# EasyEDA Pro project 单向户外电源_明月班.epro, schematic Schematic3
Board Name: 后级2; Create Date: 2025-10-12; Page Name: P1; Project Name: 单向户外电源; Schematic Name: Schematic3; Update Date: 2025-10-12; Company: 嘉立创EDA; Page Size: A4; Version: V1.0
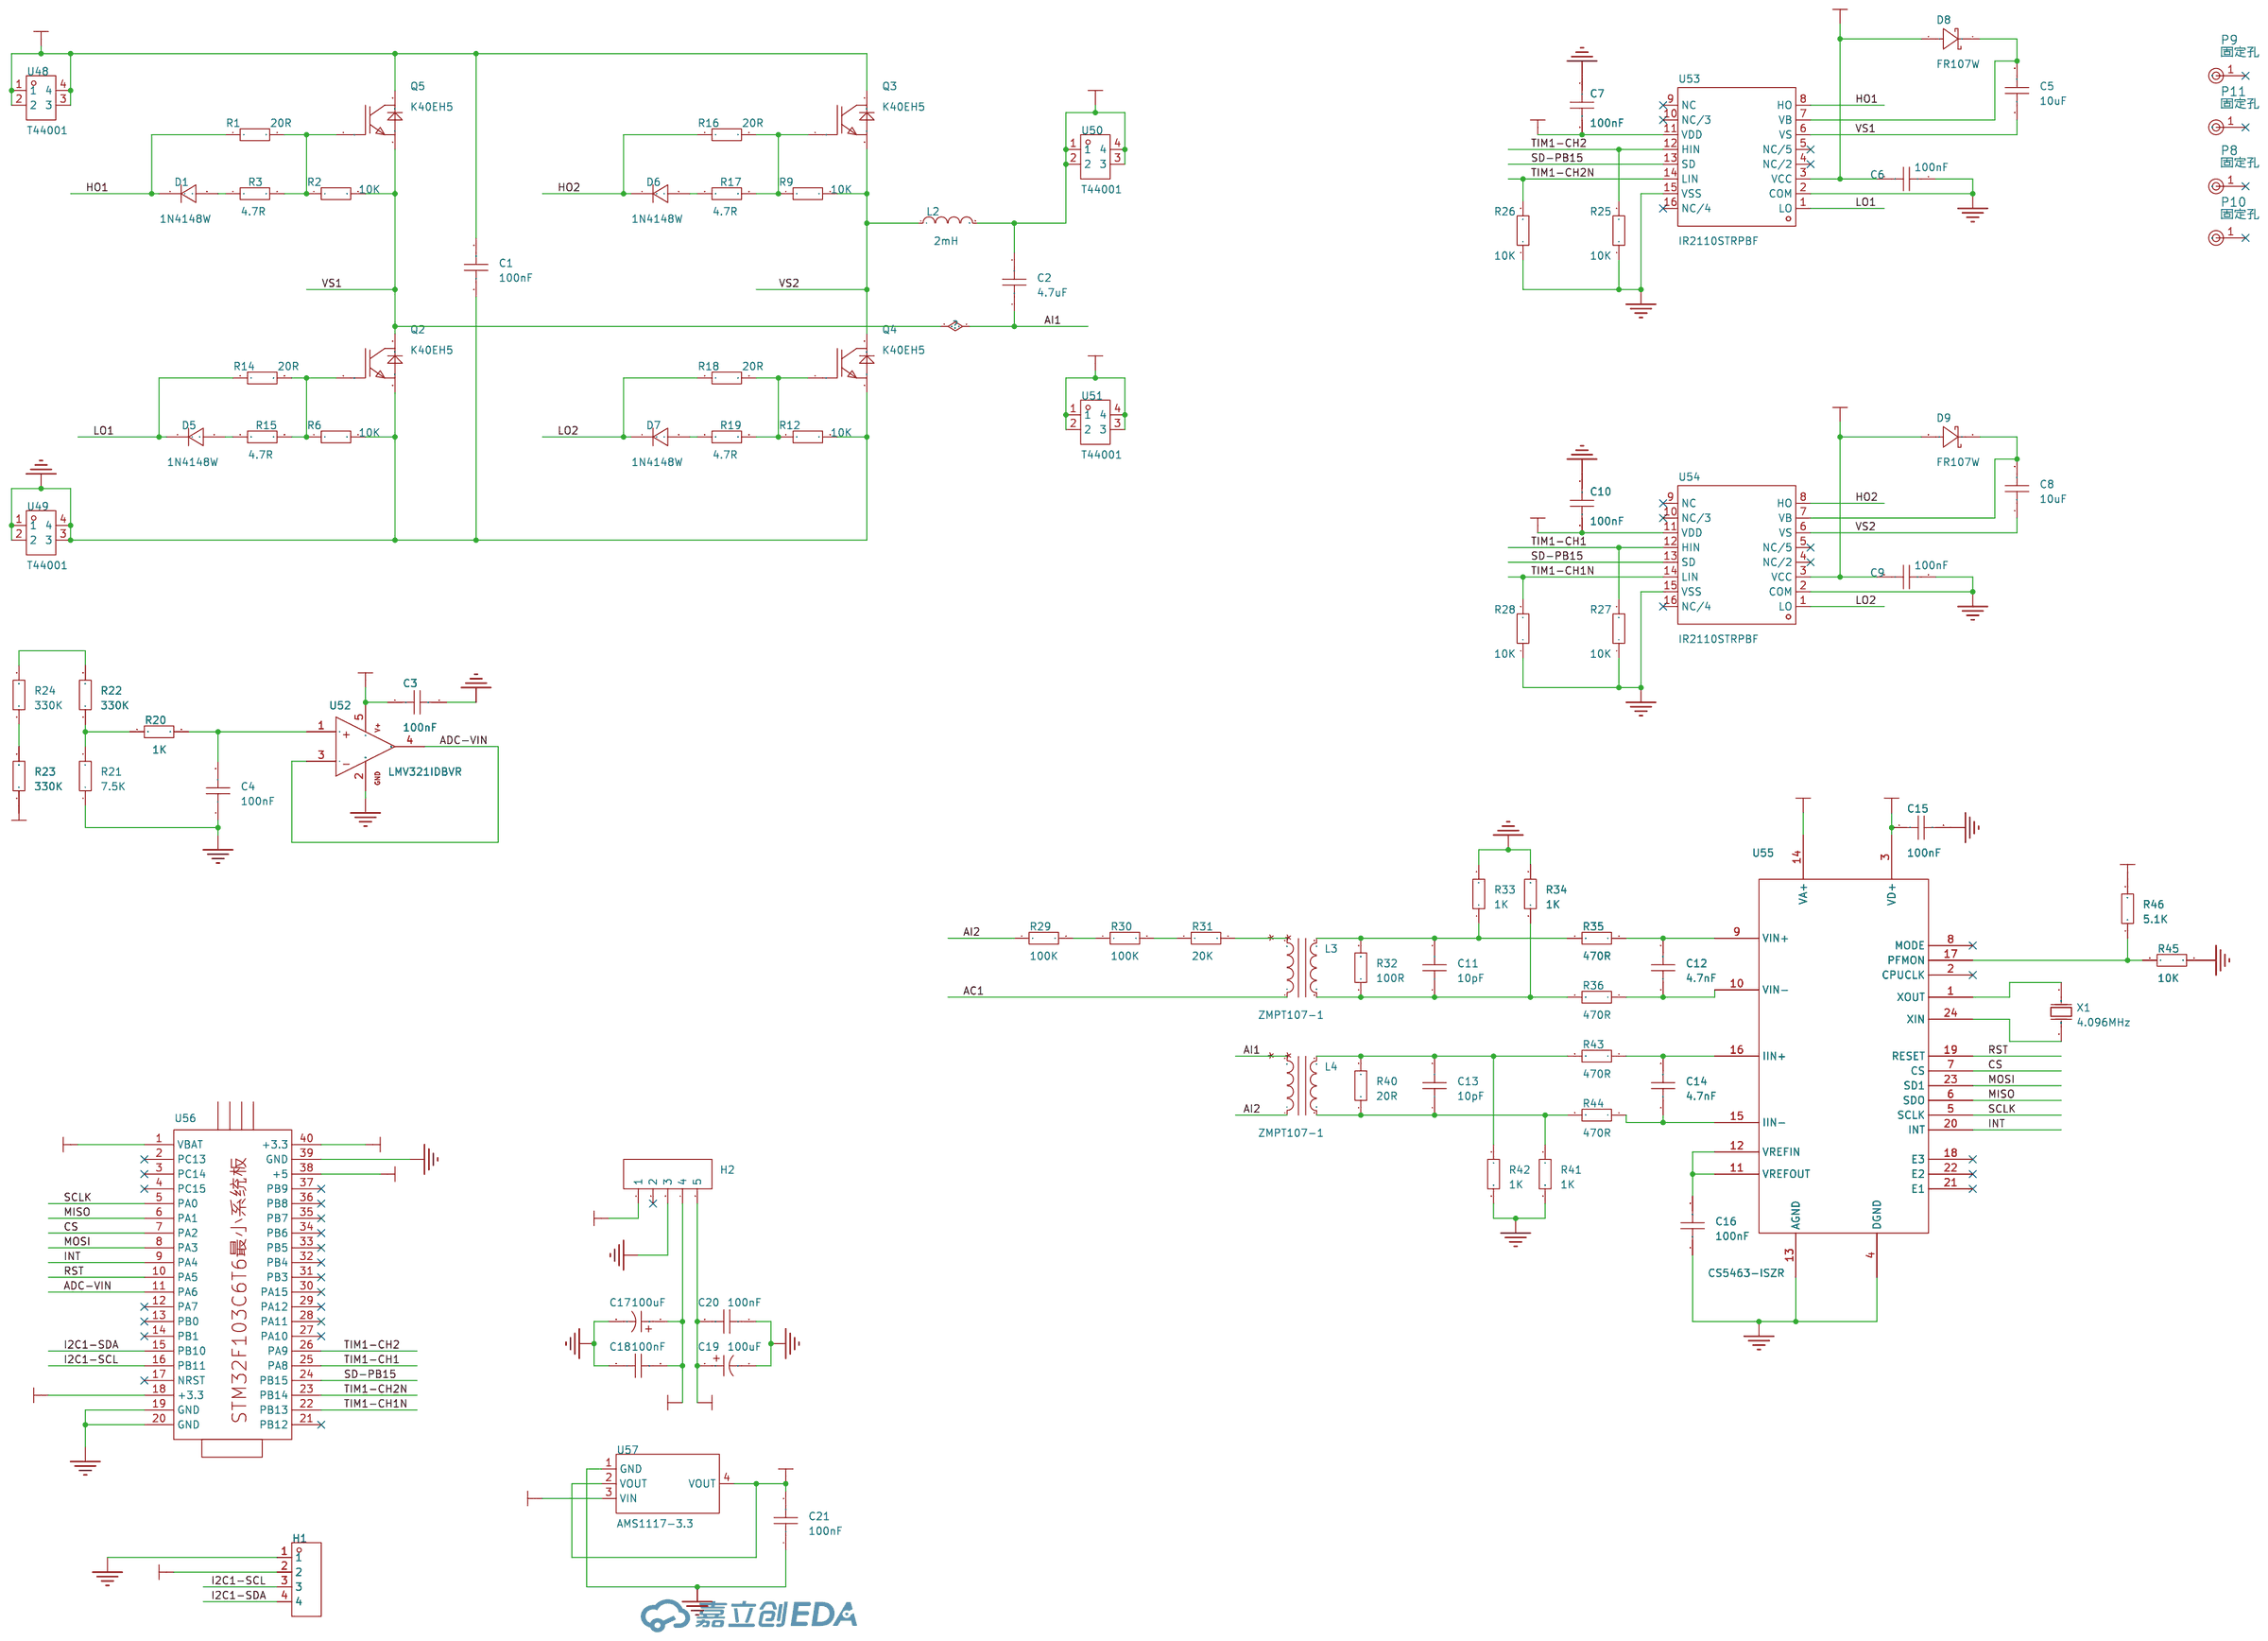
[diagram p1: schematic sheet]

## Parts
C1  100nF  [CAP-TH_L11.5-W5.5-P10.00-D0.6]
C2  4.7uF  [CAP-TH_L28.5-W15.5-P26.0-D0.8]
C3  100nF  [C0805]
C4  100nF  [C0805]
C5  10uF  [C0805]
C6  100nF  [C0805]
C7  100nF  [C0805]
C8  10uF  [C0805]
C9  100nF  [C0805]
C10  100nF  [C0805]
C11  10pF  [C0805]
C12  4.7nF  [C0805]
C13  10pF  [C0805]
C14  4.7nF  [C0805]
C15  100nF  [C0805]
C16  100nF  [C0805]
C17  100uF  [CAP-TH_BD5.0-P2.00-D0.5-FD-1]
C18  100nF  [C0805]
C19  100uF  [CAP-TH_BD5.0-P2.00-D0.5-FD-1]
C20  100nF  [C0805]
C21  100nF  [C0805]
D1  1N4148W  [SOD-123F_L2.7-W1.6-LS3.8-RD]
D5  1N4148W  [SOD-123F_L2.7-W1.6-LS3.8-RD]
D6  1N4148W  [SOD-123F_L2.7-W1.6-LS3.8-RD]
D7  1N4148W  [SOD-123F_L2.7-W1.6-LS3.8-RD]
D8  FR107W  [SOD-123FL_L2.7-W1.8-LS3.8-RD]
D9  FR107W  [SOD-123FL_L2.7-W1.8-LS3.8-RD]
H1  -  [HDR-TH_4P-P2.54-V-F]
H2  -  [EG1185辅助电源]
L2  2mH  [2mH-D=36,插件脚距16]
L3  ZMPT107-1  [XFMR-TH_ZMPT107-1]
L4  ZMPT107-1  [XFMR-TH_ZMPT107-1]
P8  固定孔  [固定孔]
P9  固定孔  [固定孔]
P10  固定孔  [固定孔]
P11  固定孔  [固定孔]
Q2  K40EH5  [TO-247AC-3_L15.8-W5.0-P5.46-L]
Q3  K40EH5  [TO-247AC-3_L15.8-W5.0-P5.46-L]
Q4  K40EH5  [TO-247AC-3_L15.8-W5.0-P5.46-L]
Q5  K40EH5  [TO-247AC-3_L15.8-W5.0-P5.46-L]
R1  20R  [R0805]
R2  10K  [R0805]
R3  4.7R  [R0805]
R6  10K  [R0805]
R9  10K  [R0805]
R12  10K  [R0805]
R14  20R  [R0805]
R15  4.7R  [R0805]
R16  20R  [R0805]
R17  4.7R  [R0805]
R18  20R  [R0805]
R19  4.7R  [R0805]
R20  1K  [R0805]
R21  7.5K  [R0805]
R22  330K  [R0805]
R23  330K  [R0805]
R24  330K  [R0805]
R25  10K  [R0805]
R26  10K  [R0805]
R27  10K  [R0805]
R28  10K  [R0805]
R29  100K  [R0805]
R30  100K  [R0805]
R31  20K  [R0805]
R32  100R  [R0805]
R33  1K  [R0805]
R34  1K  [R0805]
R35  470R  [R0805]
R36  470R  [R0805]
R40  20R  [R0805]
R41  1K  [R0805]
R42  1K  [R0805]
R43  470R  [R0805]
R44  470R  [R0805]
R45  10K  [R0805]
R46  5.1K  [R0805]
U48  T44001  [CONN-TH_T44001]
U49  T44001  [CONN-TH_T44001]
U50  T44001  [CONN-TH_T44001]
U51  T44001  [CONN-TH_T44001]
U52  LMV321IDBVR  [SOT-23-5_L3.0-W1.7-P0.95-LS2.8-BR]
U53  IR2110STRPBF  [SOIC-16_L10.3-W7.5-P1.27-LS10.3-BL]
U54  IR2110STRPBF  [SOIC-16_L10.3-W7.5-P1.27-LS10.3-BL]
U55  CS5463-ISZR  [SSOP-24_L8.1-W5.3-P0.65-LS7.8-BL]
U56  -  [STM32F103C8T6最小系统板]
U57  AMS1117-3.3  [SOT-223-3_L6.5-W3.4-P2.30-LS7.0-BR]
X1  4.096MHz  [HC-49US_L11.5-W4.5-P4.88]

## Library data of the parts
C1 = CBB21-630V104JP10: 容值:100nF;精度:±5%;额定电压:630V;工作温度:-40℃~+105℃;; LCSC Part Name: 100nF ±5% 630V; Supplier Part: C2888191; Manufacturer: 东通电子; Supplier Footprint: 插件,P=10mm; JLCPCB Part Class: 扩展库; Datasheet: https://atta.szlcsc.com/upload/public/pdf/source/20210928/C2888191_1A852CE2E5E8A960951618999EAEF1BB.pdf; Supplier: LCSC; Tolerance: ±5%; Voltage Rated: 630V; Operating Temperature: -40℃~+105℃
C2 = KP475J2J2603: 容值:4.7uF;精度:±5%;额定电压:630V;工作温度:-40℃~+100℃;; LCSC Part Name: 4.7uF ±5% 630V; Supplier Part: C3019080; Manufacturer: KYET(科雅); Supplier Footprint: 插件,P=26mm; JLCPCB Part Class: 扩展库; Datasheet: https://atta.szlcsc.com/upload/public/pdf/source/20220523/12B2B36D66F3FE6DA8C3B05150F96247.pdf; Supplier: LCSC; Tolerance: ±5%; Voltage Rated: 630V; Operating Temperature: -40℃~+100℃
C3-C16 C21 = CAP_0603: Supplier Footprint: 0603
C17 C19 = JBLE2101M025A080RLM 100UF 25V: 容值:100uF;精度:±20%;额定电压:25V;纹波电流:1.1A@100kHz;等效串联电阻(ESR):40mΩ@100kHz;; LCSC Part Name: 100uF ±20% 25V; Supplier Part: C19270657; Manufacturer: DMBJ(振宝佳); Supplier Footprint: 插件,D5xL8mm; JLCPCB Part Class: 扩展库; Datasheet: https://atta.szlcsc.com/upload/public/pdf/source/20240115/41B2053578AA7A05F5193847DE8DA961.pdf; Supplier: LCSC; Tolerance: ±20%; Voltage Rating: 25V; Ripple Current: 1.1A@100kHz; Equivalent Series Resistance(ESR): 40mΩ@100kHz; Lifetime: 2000hrs@105℃
C18 C20 = CAP_0805: Supplier Footprint: 0805
D1 D5-D7 = 1N4148W_C81598: 二极管配置:独立式;正向压降(Vf):1V@50mA;直流反向耐压(Vr):75V;整流电流:150mA;反向恢复时间(Trr):4ns;; Supplier Part: C81598; Manufacturer: ST(先科); Supplier Footprint: SOD-123; JLCPCB Part Class: 基础库; Datasheet: https://item.szlcsc.com/datasheet/1N4148W/82750.html; Supplier: LCSC; Diode Configuration: 独立式; Voltage - Forward(Vf@If): 1V@50mA; Voltage - DC Reverse(Vr): 75V; Current - Rectified: 150mA; Pd - Power Dissipation: 400mW; Reverse Leakage Current (Ir): 1uA@75V; Reverse Recovery Time (trr): 4ns; Non-Repetitive Peak Forward Surge Current: 1A
D8 D9 = FR107W_C18199114: 二极管配置:独立式;正向压降(Vf):1.3V@1.0A;直流反向耐压(Vr):1kV;整流电流:1A;反向恢复时间(Trr):500ns;; LCSC Part Name: 耐压:1000V 电流:1A 反向恢复时间：500ns; Supplier Part: C18199114; Manufacturer: R+O(宏嘉诚); Supplier Footprint: SOD-123FL; JLCPCB Part Class: 扩展库; Datasheet: https://item.szlcsc.com/datasheet/FR107W/19354346.html; Supplier: LCSC; Diode Configuration: 独立式; Voltage - Forward(Vf@If): 1.3V@1.0A; Voltage - DC Reverse(Vr): 1kV; Current - Rectified: 1A; Reverse Leakage Current (Ir): 2uA@1000V; Reverse Recovery Time (trr): 500ns; Operating Junction Temperature Range: -55℃~+150℃; Non-Repetitive Peak Forward Surge Current: 30A
H1 = HDR-F_2.54_1x4P: Supplier Part: C2718488; Supplier Footprint: 插件
H2 = HDR-F_2.54_1x5P: Supplier Part: C50950; Supplier Footprint: 插件
L2 = XR050125T101MVL7: 电感值:100uH;精度:±10%;额定电流:3.8A;类型:磁环电感;; LCSC Part Name: 100uH ±10% 磁环电感; Supplier Part: C18213920; Manufacturer: XR(祥如); Supplier Footprint: 插件,D=15.8mm; JLCPCB Part Class: 扩展库; Datasheet: https://atta.szlcsc.com/upload/public/pdf/source/20231010/3953EFE02023CF281EBE5E0AF59C2C67.pdf; Supplier: LCSC; Tolerance: ±10%; Rated Current: 3.8A; Type: 磁环电感; Wire Diameter: 0.7mm
L3 L4 = ZMPT107-1_C125191: 类型:电压互感器;匝数比:1:1;额定输入电流:2mA;额定输出电流:2mA;频率:-;次级侧电感值:-;; Supplier Part: C125191; Manufacturer: 择明朗熙; Supplier Footprint: 插件; JLCPCB Part Class: 扩展库; Datasheet: https://item.szlcsc.com/datasheet/ZMPT107-1/136467.html; Supplier: LCSC; Type: 电压互感器; Turns Ratio: 1:1; Rated input Current: 2mA; Rated Output Current: 2mA; Linearity: 0.2%
P8-P11 = 固定孔
Q2-Q5 = IKW20N60T: Vce=600V，Ic=20A，Vce(sat)=1.5V; Supplier Part: C10456; Manufacturer: Infineon(英飞凌); Supplier Footprint: TO-247AC-3; JLCPCB Part Class: 扩展库; Datasheet: https://atta.szlcsc.com/upload/public/pdf/source/20121215/1457706569365.pdf; Supplier: LCSC
R1-R3 R6 R9 R12 R14-R19 = Res_0805: Supplier Footprint: 0805
R20-R36 R40-R46 = Res_0603: Supplier Footprint: 0603
U48-U51 = T44001: LCSC Part Name: 四脚 M4 二件套; Supplier Part: C481447; Manufacturer: XFCN(兴飞); Supplier Footprint: 插件; JLCPCB Part Class: 扩展库; Datasheet: https://atta.szlcsc.com/upload/public/pdf/source/20200107/C481448_4214B4EB74A46B70BD82BA8A456D4EDD.pdf; Supplier: LCSC
U52 = LMV321IDBVR_C7972: 放大器数:单路;轨到轨:轨到轨输出;增益带宽积(GBP):1MHz;输入失调电压(Vos):7mV;压摆率(SR):1V/us;输入偏置电流(Ib):11nA;; LCSC Part Name: 低电压轨到轨输出运算放大器; Supplier Part: C7972; Manufacturer: TI(德州仪器); Supplier Footprint: SOT-23-5; JLCPCB Part Class: 扩展库; Datasheet: https://www.ti.com/cn/lit/gpn/lmv321; Supplier: LCSC; Number of Channels: 单路; Maximum Power Supply Range (Vdd-Vss): 5.5V; Rail to Rail: 轨到轨输出; Gain Bandwidth Product: 1MHz; Vos - Input Offset Voltage: 7mV; Input Offset Voltage Drift(Vos TC): 9uV/℃; Slew Rate: 1V/us; Ib - Input Bias Current: 11nA; Input Offset Current(Ios): 5nA; Noise density(eN): 46nV/√Hz@1kHz; Common Mode Rejection Ratio(CMRR): 63dB; Quiescent Current: 170uA; Output Current: 5mA; Operating Temperature: -40℃~+125℃; Single supply: 2.7V~5.5V
U53 U54 = IR2110STRPBF: 驱动配置:半桥;负载类型:IGBT；MOSFET;驱动通道数:2;灌电流(IOL):2A;拉电流(IOH):2A;工作电压:10V~20V;上升时间(tr):110ns;下降时间(tf):25ns;; LCSC Part Name: 高端和低端驱动器; Supplier Part: C2968; Manufacturer: Infineon(英飞凌); Supplier Footprint: SOIC-16-300mil; JLCPCB Part Class: 扩展库; Datasheet: https://item.szlcsc.com/datasheet/IR2110STRPBF/3350.html; Supplier: LCSC; Driven Configuration: 半桥; Load Type: IGBT；MOSFET; Number of Drivers: 2; Current - Output Low(IOL): 2A; Current - Output High(IOH): 2A; Voltage - Supply: 10V~20V; Rise Time: 110ns; Fall Time: 25ns; Propagation Delay tpLH: 120ns; Propagation Delay tpHL: 94ns; Features: 欠压保护(UVP); Operating Temperature: -40℃~+150℃@(Tj); Quiescent Current(Iq): 180uA
U55 = CS5463
U56 = STM32F103C6T6
U57 = AMS1117-3.3_C6186: 输出类型:固定;工作电压:16V;输出电压:3.3V;输出电流:1A;电源纹波抑制比(PSRR):72dB@(120Hz);输出极性:正极;; LCSC Part Name: 输出3.3V 1A; Supplier Part: C6186; Manufacturer: AMS; Supplier Footprint: SOT-223; JLCPCB Part Class: 基础库; Datasheet: https://item.szlcsc.com/datasheet/AMS1117-3.3/6652.html; Supplier: LCSC; Output Type: 固定; Voltage - Supply: 16V; Output Voltage: 3.3V; Output Current: 1A; Power Supply Rejection Ratio (PSRR): 72dB@(120Hz); Voltage Dropout: 1.1V@(800mA); standby current: 5mA; Features: 过流保护；过热保护; Operating Temperature: -40℃~+125℃; Output Configuration: 正极; Number of Outputs: 1
X1 = X49SD4096MSD2SC-1: 晶振类型:直插晶振;频率:4.096MHz;常温频差:±20ppm;负载电容:20pF;频率稳定度:±30ppm;; LCSC Part Name: HC-49US 4.096MHZ 2P 49S 20PF ±20PPM -20~70℃（±30PPM）; Supplier Part: C2226; Manufacturer: YXC(扬兴晶振); Supplier Footprint: HC-49S; JLCPCB Part Class: 扩展库; Datasheet: https://item.szlcsc.com/datasheet/X49SD4096MSD2SC-1/2595.html; Supplier: LCSC; Type: 直插晶振; Normal temperature Frequency Tolerance: ±20ppm; Load Capacitance: 20pF; Frequency Stability: ±30ppm; Operating Temperature: -20℃~+70℃

## Nets
3.3V: C3.1 C7.2 C10.2 C15.1 C21.2 U52.5(V+) U53.11(VDD) U54.11(VDD) U55.3(VD+) U56.1(VBAT) U56.18(+3.3) U56.40(+3.3) U57.2(VOUT) U57.4(VOUT)
5V: C19.1 C20.2 H1.2 H2.5 R46.2 U55.14(VA+) U56.38(+5) U57.3(VIN)
15V: C6.2 C9.2 C17.1 C18.2 D8.2(A) D9.2(A) H2.4 U53.3(VCC) U54.3(VCC)
400V: C1.2 H2.1 Q3.2(C) Q5.2(C) R23.1 U48.1 U48.2 U48.3 U48.4
GND-400V: C1.1 C3.2 C4.1 C6.1 C7.1 C9.1 C10.1 C15.2 C16.1 C17.2 C18.1 C19.2 C20.1 C21.1 H1.1 H2.3 Q2.3(E) Q4.3(E) R6.2 R12.2 R21.1 R25.1 R26.1 R27.1 R28.1 R33.2 R34.2 R41.2 R42.2 R45.2 U49.1 U49.2 U49.3 U49.4 U52.2(GND) U53.2(COM) U53.15(VSS) U54.2(COM) U54.15(VSS) U55.4(DGND) U55.13(AGND) U56.19(GND) U56.20(GND) U56.39(GND) U57.1(GND)
AC1: C2.2 L2.2 L3.4 U50.1 U50.2 U50.3 U50.4
ADC-VIN: U52.3(-) U52.4(OUT) U56.11(PA6)
AI1: C2.1 C5.1 L4.3 Q2.2(C) Q5.3(E) R2.2 U53.6(VS)
AI2: L4.4 R29.1 U51.1 U51.2 U51.3 U51.4
CS: U55.7(CS) U56.7(PA2)
HO1: D1.1(K) R1.1 U53.8(HO)
HO2: D6.1(K) R16.1 U54.8(HO)
I2C1-SCL: H1.3 U56.16(PB11)
I2C1-SDA: H1.4 U56.15(PB10)
INT: U55.20(INT) U56.9(PA4)
LO1: D5.1(K) R14.1 U53.1(LO)
LO2: D7.1(K) R18.1 U54.1(LO)
MISO: U55.6(SDO) U56.6(PA1)
MOSI: U55.23(SD1) U56.8(PA3)
RST: U55.19(RESET) U56.10(PA5)
SCLK: U55.5(SCLK) U56.5(PA0)
SD-PB15: U53.13(SD) U54.13(SD) U56.24(PB15)
TIM1-CH1: R27.2 U54.12(HIN) U56.25(PA8)
TIM1-CH1N: R28.2 U54.14(LIN) U56.22(PB13)
TIM1-CH2: R25.2 U53.12(HIN) U56.26(PA9)
TIM1-CH2N: R26.2 U53.14(LIN) U56.23(PB14)
VS2: C8.1 L2.1 Q3.3(E) Q4.2(C) R9.2 U54.6(VS)
$1N804: D1.2(A) R3.1
$1N805: Q5.1(G) R1.2 R2.1 R3.2
$1N811: Q2.1(G) R6.1 R14.2 R15.2
$1N816: Q3.1(G) R9.1 R16.2 R17.2
$1N820: Q4.1(G) R12.1 R18.2 R19.2
$1N1530: D5.2(A) R15.1
$1N1623: D6.2(A) R17.1
$1N1905: D7.2(A) R19.1
$1N3599: C4.2 R20.2 U52.1(+)
$1N3773: R23.2 R24.1
$1N3777: R22.2 R24.2
$1N3784: R20.1 R21.2 R22.1
$1N4444: C5.2 D8.1(K) U53.7(VB)
$1N5054: C8.2 D9.1(K) U54.7(VB)
$1N6302: R29.2 R30.1
$1N6306: R30.2 R31.1
$1N6311: L3.3 R31.2
$1N6556: C11.2 L3.1 R32.2 R33.1 R35.2
$1N6599: C11.1 L3.2 R32.1 R34.1 R36.2
$1N6618: C12.1 R36.1 U55.10(VIN-)
$1N6632: C12.2 R35.1 U55.9(VIN+)
$1N6969: C13.2 L4.1 R40.2 R42.1 R43.2
$1N6975: C13.1 L4.2 R40.1 R41.1 R44.2
$1N6981: C14.1 R44.1 U55.15(IIN-)
$1N6985: C14.2 R43.1 U55.16(IIN+)
$1N7319: R45.1 R46.1 U55.17(PFMON)
$1N7435: U55.1(XOUT) X1.1(OSC1)
$1N7441: U55.24(XIN) X1.2(OSC2)
$1N7506: C16.2 U55.11(VREFOUT) U55.12(VREFIN)

Not connected (* = marked no-connect by the designer): H2 2*; P8 1(3mm洞)*; P9 1(3mm洞)*; P10 1(3mm洞)*; P11 1(3mm洞)*; U53 4(NC/2)* 5(NC/5)* 9(NC)* 10(NC/3)* 16(NC/4)*; U54 4(NC/2)* 5(NC/5)* 9(NC)* 10(NC/3)* 16(NC/4)*; U55 2(CPUCLK)* 8(MODE)* 18(E3)* 21(E1)* 22(E2)*; U56 2(PC13)* 3(PC14)* 4(PC15)* 12(PA7)* 13(PB0)* 14(PB1)* 17(NRST)* 21(PB12)* 27(PA10)* 28(PA11)* 29(PA12)* 30(PA15)* 31(PB3)* 32(PB4)* 33(PB5)* 34(PB6)* 35(PB7)* 36(PB8)* 37(PB9)*
